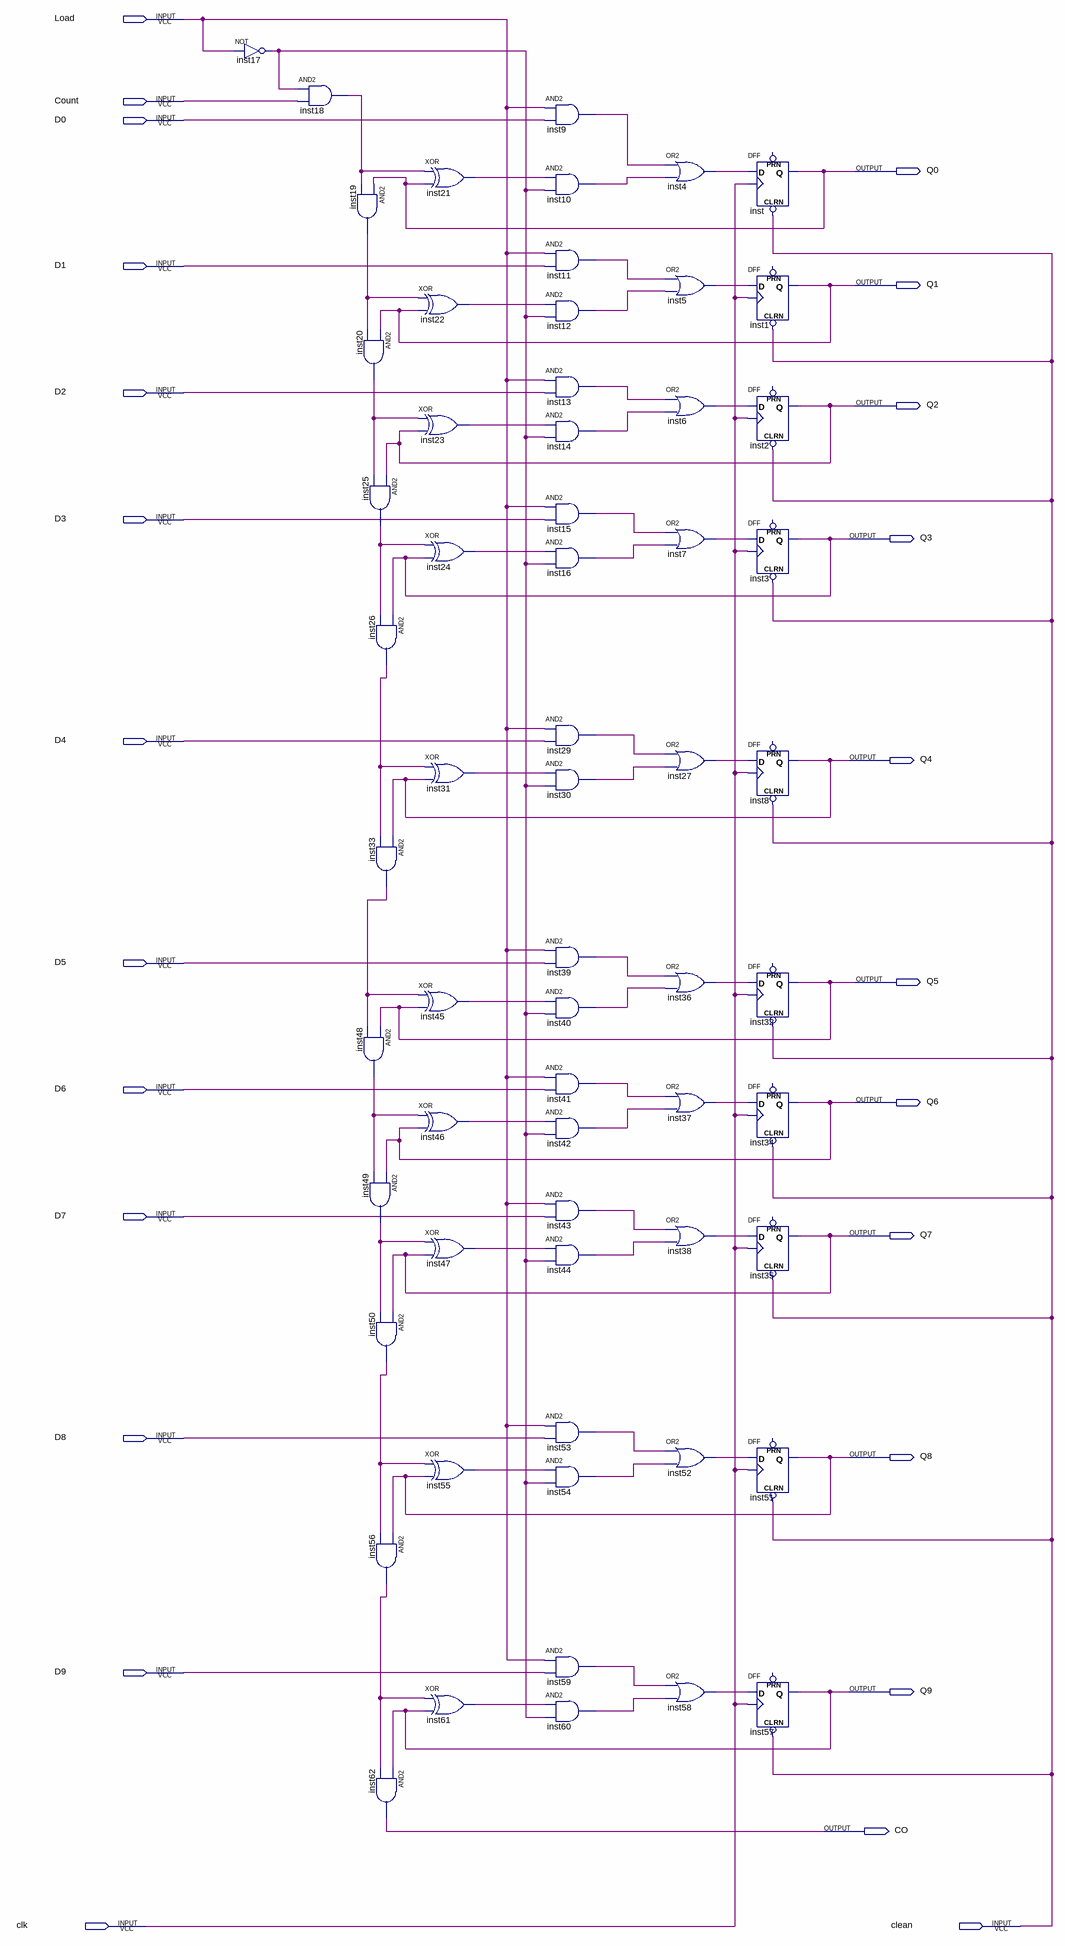
[diagram p0: schematic sheet]
// Quartus schematic Block4.bdf as structural Verilog: 62 symbols, 25 pins
module Block4 (
  input  Load,
  input  Count,
  input  D0,
  input  D1,
  input  D2,
  input  D3,
  input  D4,
  input  D5,
  input  D6,
  input  D7,
  input  D8,
  input  D9,
  input  clk,
  input  clean,
  output Q0,
  output Q1,
  output Q2,
  output Q3,
  output Q4,
  output Q5,
  output Q6,
  output Q7,
  output Q8,
  output Q9,
  output CO
);

  wire inst4_out, inst5_out, inst6_out, inst7_out, inst9_out, inst10_out, inst11_out, inst12_out, inst13_out,
       inst14_out, inst15_out, inst16_out, inst17_out, inst18_out, inst19_out, inst20_out, inst21_out,
       inst22_out, inst23_out, inst24_out, inst25_out, inst26_out, inst27_out, inst29_out, inst30_out,
       inst31_out, inst33_out, inst36_out, inst37_out, inst38_out, inst39_out, inst40_out, inst41_out,
       inst42_out, inst43_out, inst44_out, inst45_out, inst46_out, inst47_out, inst48_out, inst49_out,
       inst50_out, inst52_out, inst53_out, inst54_out, inst55_out, inst56_out, inst58_out, inst59_out,
       inst60_out, inst61_out;

  not inst17 (inst17_out, Load);
  and inst18 (inst18_out, inst17_out, Count);
  and inst19 (inst19_out, Q0, inst18_out);
  and inst20 (inst20_out, Q1, inst19_out);
  and inst25 (inst25_out, Q2, inst20_out);
  and inst26 (inst26_out, Q3, inst25_out);
  and inst33 (inst33_out, Q4, inst26_out);
  and inst48 (inst48_out, Q5, inst33_out);
  and inst49 (inst49_out, Q6, inst48_out);
  and inst50 (inst50_out, Q7, inst49_out);
  and inst56 (inst56_out, Q8, inst50_out);
  and inst62 (CO, Q9, inst56_out);
  xor inst21 (inst21_out, inst18_out, Q0);
  xor inst22 (inst22_out, inst19_out, Q1);
  xor inst23 (inst23_out, inst20_out, Q2);
  xor inst24 (inst24_out, inst25_out, Q3);
  xor inst31 (inst31_out, inst26_out, Q4);
  xor inst45 (inst45_out, inst33_out, Q5);
  xor inst46 (inst46_out, inst48_out, Q6);
  xor inst47 (inst47_out, inst49_out, Q7);
  xor inst55 (inst55_out, inst50_out, Q8);
  xor inst61 (inst61_out, inst56_out, Q9);
  and inst9 (inst9_out, Load, D0);
  and inst10 (inst10_out, inst21_out, inst17_out);
  and inst11 (inst11_out, Load, D1);
  and inst12 (inst12_out, inst22_out, inst17_out);
  and inst13 (inst13_out, Load, D2);
  and inst14 (inst14_out, inst23_out, inst17_out);
  and inst15 (inst15_out, Load, D3);
  and inst16 (inst16_out, inst24_out, inst17_out);
  and inst29 (inst29_out, Load, D4);
  and inst30 (inst30_out, inst31_out, inst17_out);
  and inst39 (inst39_out, Load, D5);
  and inst40 (inst40_out, inst45_out, inst17_out);
  and inst41 (inst41_out, Load, D6);
  and inst42 (inst42_out, inst46_out, inst17_out);
  and inst43 (inst43_out, Load, D7);
  and inst44 (inst44_out, inst47_out, inst17_out);
  and inst53 (inst53_out, Load, D8);
  and inst54 (inst54_out, inst55_out, inst17_out);
  and inst59 (inst59_out, Load, D9);
  and inst60 (inst60_out, inst61_out, inst17_out);
  or inst4 (inst4_out, inst9_out, inst10_out);
  or inst5 (inst5_out, inst11_out, inst12_out);
  or inst6 (inst6_out, inst13_out, inst14_out);
  or inst7 (inst7_out, inst15_out, inst16_out);
  or inst27 (inst27_out, inst29_out, inst30_out);
  or inst36 (inst36_out, inst39_out, inst40_out);
  or inst37 (inst37_out, inst41_out, inst42_out);
  or inst38 (inst38_out, inst43_out, inst44_out);
  or inst52 (inst52_out, inst53_out, inst54_out);
  or inst58 (inst58_out, inst59_out, inst60_out);
  DFF inst (.CLRN(clean), .CLK(clk), .D(inst4_out), .Q(Q0));  // open: PRN
  DFF inst1 (.CLRN(clean), .CLK(clk), .D(inst5_out), .Q(Q1));  // open: PRN
  DFF inst2 (.CLRN(clean), .CLK(clk), .D(inst6_out), .Q(Q2));  // open: PRN
  DFF inst3 (.CLRN(clean), .CLK(clk), .D(inst7_out), .Q(Q3));  // open: PRN
  DFF inst8 (.CLRN(clean), .CLK(clk), .D(inst27_out), .Q(Q4));  // open: PRN
  DFF inst32 (.CLRN(clean), .CLK(clk), .D(inst36_out), .Q(Q5));  // open: PRN
  DFF inst34 (.CLRN(clean), .CLK(clk), .D(inst37_out), .Q(Q6));  // open: PRN
  DFF inst35 (.CLRN(clean), .CLK(clk), .D(inst38_out), .Q(Q7));  // open: PRN
  DFF inst51 (.CLRN(clean), .CLK(clk), .D(inst52_out), .Q(Q8));  // open: PRN
  DFF inst57 (.CLRN(clean), .CLK(clk), .D(inst58_out), .Q(Q9));  // open: PRN
endmodule
